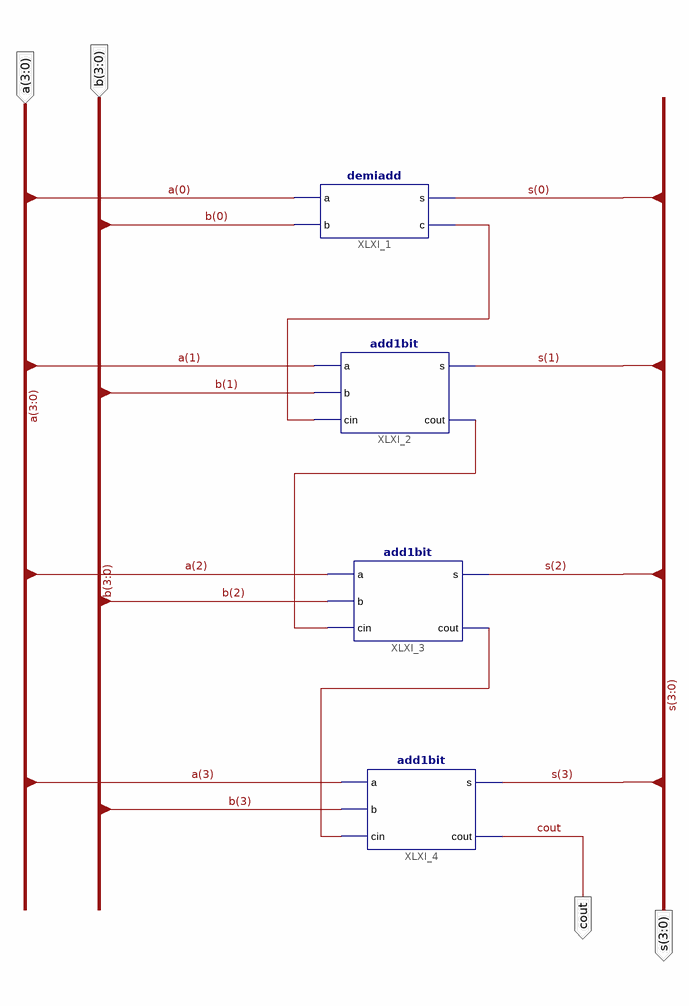
[diagram p0: schematic sheet 1]
// Xilinx ISE schematic add4bit.sch (spartan3e) as structural Verilog: 4 symbols, 4 ports
module add4bit (
  input  [3:0] a,
  input  [3:0] b,
  output [3:0] s,
  output cout
);

  wire XLXN_13, XLXN_16, XLXN_17;

  demiadd XLXI_1 (.a(a[0]), .b(b[0]), .s(s[0]), .c(XLXN_13));
  add1bit XLXI_2 (.a(a[1]), .b(b[1]), .cin(XLXN_13), .s(s[1]), .cout(XLXN_17));
  add1bit XLXI_3 (.a(a[2]), .b(b[2]), .cin(XLXN_17), .s(s[2]), .cout(XLXN_16));
  add1bit XLXI_4 (.a(a[3]), .b(b[3]), .cin(XLXN_16), .s(s[3]), .cout(cout));
endmodule
